# Altium schematic sheet real.SchDoc
size A; SheetNumber: 2; SheetTotal: 2
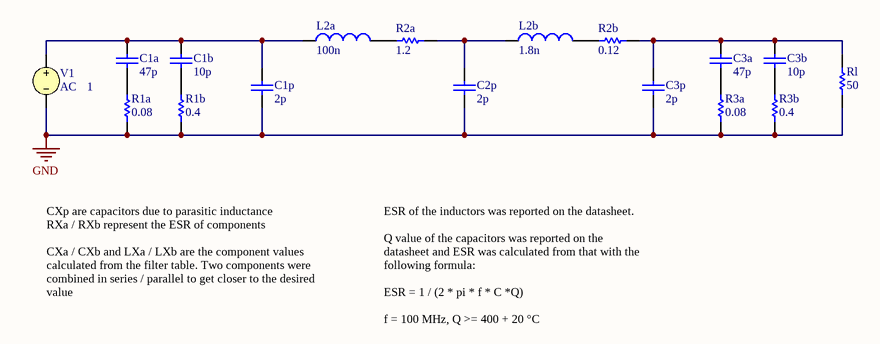
[diagram p0: real.SchDoc]

## Parts
C1a  value 47p  (hidden comment: Capacitor)
C1b  value 10p  (hidden comment: Capacitor)
C1p  value 2p  (hidden comment: Capacitor)
C2p  value 2p  (hidden comment: Capacitor)
C3a  value 47p  (hidden comment: Capacitor)
C3b  value 10p  (hidden comment: Capacitor)
C3p  value 2p  (hidden comment: Capacitor)
L2a  value 100n  (hidden comment: Inductor)
L2b  value 1.8n  (hidden comment: Inductor)
R1a  value 0.08  (hidden comment: Resistor)
R1b  value 0.4  (hidden comment: Resistor)
R2a  value 1.2  (hidden comment: Resistor)
R2b  value 0.12  (hidden comment: Resistor)
R3a  value 0.08  (hidden comment: Resistor)
R3b  value 0.4  (hidden comment: Resistor)
Rl  value 50  (hidden comment: Resistor)
V1  AC Magnitude: 1  (hidden comment: DC)

## Nets
GND: C1p.1 C2p.1 C3p.1 R1a.1 R1b.1 R3a.1 R3b.1 Rl.1 V1.2
NetC1a_1: C1a.1 R1a.2
NetC1a_2: C1a.2 C1b.2 C1p.2 L2a.1 V1.1
NetC1b_1: C1b.1 R1b.2
NetC2p_2: C2p.2 L2b.1 R2a.1
NetC3a_1: C3a.1 R3a.2
NetC3a_2: C3a.2 C3b.2 C3p.2 R2b.1 Rl.2
NetC3b_1: C3b.1 R3b.2
NetL2a_2: L2a.2 R2a.2
NetL2b_2: L2b.2 R2b.2

## Notes on the sheet
- (near V1) AC
- CXp are capacitors due to parasitic inductance
  RXa / RXb represent the ESR of components
  CXa / CXb and LXa / LXb are the component values calculated from the filter table. Two components were combined in series / parallel to get closer to the desired value
- ESR of the inductors was reported on the datasheet.
  Q value of the capacitors was reported on the datasheet and ESR was calculated from that with the following formula:
  ESR = 1 / (2 * pi * f * C *Q)
  f = 100 MHz, Q >= 400 + 20 °C

## Library data of the parts
C1a C1b C1p C2p C3a C3b C3p = Capacitor: SimulationGenericComponent: True
L2a L2b = Inductor: SimulationGenericComponent: True
R1a R1b R2a R2b R3a R3b Rl = Resistor: TC1: 0; SimulationGenericComponent: True; TC2: 0
V1 = VSRC: Voltage Source; Note: PCB Footprint - Not required; AC Phase: Rser=50; Published: 8-Jun-2000; LatestRevisionDate: 17-Jul-2002; LatestRevisionNote: Re-released for DXP Platform.; PackageReference: Not Applicable; Publisher: Altium Limited